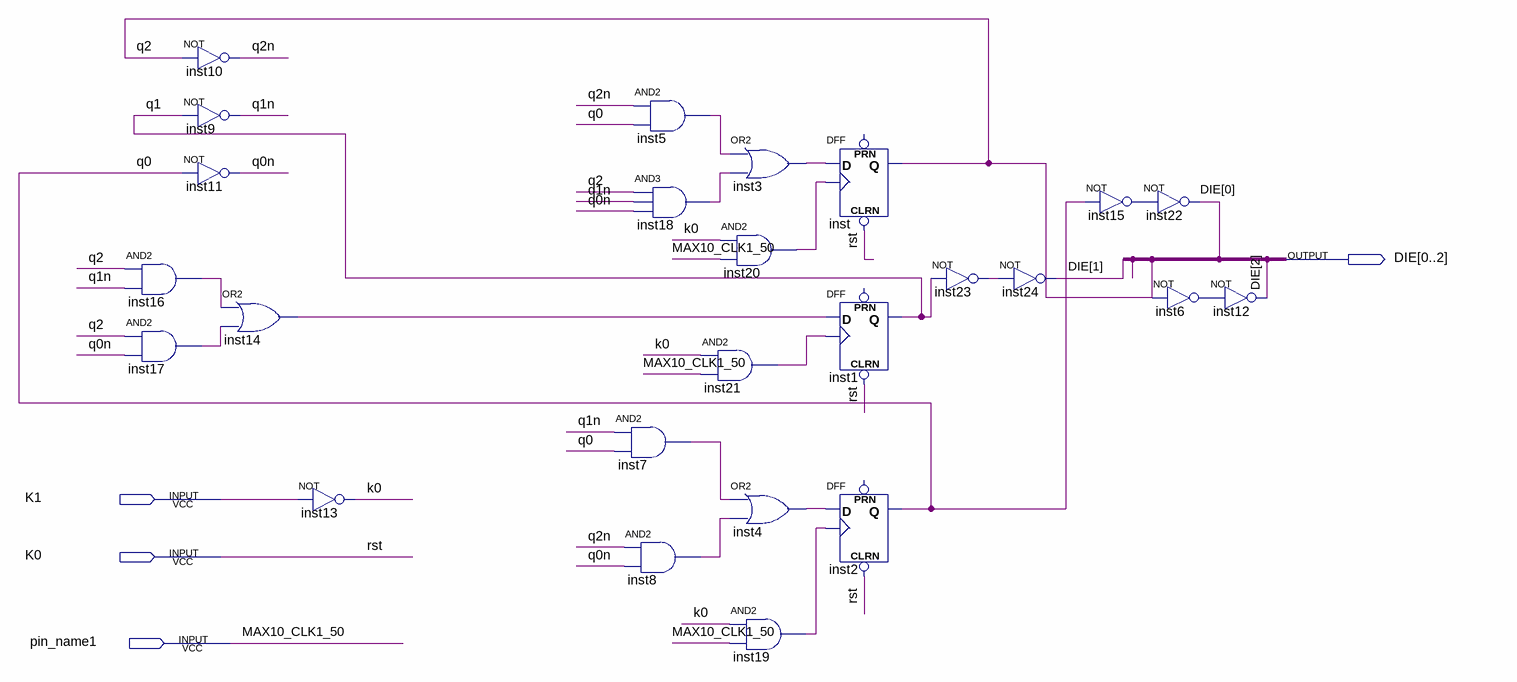
[diagram p0: schematic sheet]
// Quartus schematic diceroll.bdf as structural Verilog: 25 symbols, 4 pins
module diceroll (
  input  K1,
  input  K0,
  input  pin_name1,
  output [0:2] DIE
);

  wire inst3_out, inst4_out, inst5_out, inst6_out, inst7_out, inst8_out, inst14_out, inst15_out, inst16_out,
       inst17_out, inst18_out, inst19_out, inst20_out, inst21_out, inst23_out, q0, q0n, q1, q1n, q2, q2n;

  and inst16 (inst16_out, q2, q1n);
  and inst17 (inst17_out, q2, q0n);
  not inst10 (q2n, q2);
  not inst9 (q1n, q1);
  not inst11 (q0n, q0);
  or inst14 (inst14_out, inst16_out, inst17_out);
  not inst13 (K0, K1);
  and inst5 (inst5_out, q2n, q0);
  and inst18 (inst18_out, q2, q1n, q0n);
  and inst7 (inst7_out, q1n, q0);
  and inst8 (inst8_out, q2n, q0n);
  and inst21 (inst21_out, K0, pin_name1);
  or inst3 (inst3_out, inst5_out, inst18_out);
  and inst20 (inst20_out, K0, pin_name1);
  or inst4 (inst4_out, inst7_out, inst8_out);
  and inst19 (inst19_out, K0, pin_name1);
  DFF inst (.CLRN(K0), .CLK(inst20_out), .D(inst3_out), .Q(q2));  // open: PRN
  DFF inst1 (.CLRN(K0), .CLK(inst21_out), .D(inst14_out), .Q(q1));  // open: PRN
  DFF inst2 (.CLRN(K0), .CLK(inst19_out), .D(inst4_out), .Q(q0));  // open: PRN
  not inst23 (inst23_out, q1);
  not inst24 (DIE[1], inst23_out);
  not inst15 (inst15_out, q0);
  not inst22 (DIE[0], inst15_out);
  not inst6 (inst6_out, q2);
  not inst12 (DIE[2], inst6_out);

  // Other names for the same wires on the sheet: MAX10_CLK1_50 = pin_name1; rst = K0
endmodule
